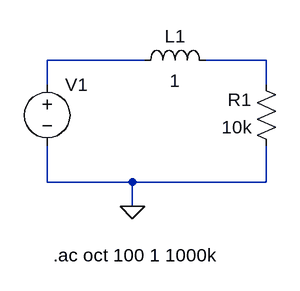
[diagram p0: schematic RL-passbasso.asc]
RL-passbasso.asc, the LTspice schematic file:
Version 4
SHEET 1 880 680
WIRE 192 224 64 224
WIRE 352 224 272 224
WIRE 64 256 64 224
WIRE 352 256 352 224
WIRE 64 384 64 336
WIRE 176 384 64 384
WIRE 352 384 352 336
WIRE 352 384 176 384
WIRE 176 416 176 384
FLAG 176 416 0
SYMBOL res 368 352 R180
WINDOW 0 36 76 Left 2
WINDOW 3 36 40 Left 2
SYMATTR InstName R1
SYMATTR Value 10k
SYMBOL voltage 64 240 R0
SYMATTR InstName V1
SYMATTR Value ""
SYMATTR Value2 AC 1
SYMBOL ind 176 240 R270
WINDOW 0 32 56 VTop 2
WINDOW 3 5 56 VBottom 2
SYMATTR InstName L1
SYMATTR Value 1
TEXT 72 480 Left 2 !.ac oct 100 1 1000k

The netlist it stands for:
* RL-passbasso.asc
R1 0 N002 10k
V1 N001 0 AC 1
L1 N001 N002 1
.ac oct 100 1 1000k
.backanno
.end